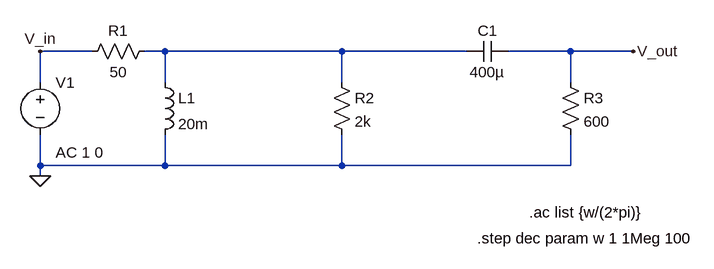
[diagram p0: schematic UE9_circuit.asc]
UE9_circuit.asc, the LTspice schematic file:
Version 4
SHEET 1 1116 680
WIRE 48 80 -32 80
WIRE 160 80 128 80
WIRE 432 80 160 80
WIRE 624 80 432 80
WIRE 784 80 688 80
WIRE 880 80 784 80
WIRE -32 128 -32 80
WIRE 160 128 160 80
WIRE 432 128 432 80
WIRE 784 128 784 80
WIRE -32 256 -32 208
WIRE 160 256 160 208
WIRE 160 256 -32 256
WIRE 432 256 432 208
WIRE 432 256 160 256
WIRE 784 256 784 208
WIRE 784 256 432 256
WIRE -32 272 -32 256
FLAG -32 272 0
FLAG -32 80 V_in
FLAG 880 80 V_out
SYMBOL res 144 64 R90
WINDOW 0 0 56 VBottom 2
WINDOW 3 32 56 VTop 2
SYMATTR InstName R1
SYMATTR Value 50
SYMBOL ind 144 112 R0
SYMATTR InstName L1
SYMATTR Value 20m
SYMBOL res 416 112 R0
SYMATTR InstName R2
SYMATTR Value 2k
SYMBOL res 768 112 R0
SYMATTR InstName R3
SYMATTR Value 600
SYMBOL cap 688 64 R90
WINDOW 0 0 32 VBottom 2
WINDOW 3 32 32 VTop 2
SYMATTR InstName C1
SYMATTR Value 400µ
SYMBOL voltage -32 112 R0
WINDOW 123 24 124 Left 2
WINDOW 39 0 0 Left 0
SYMATTR InstName V1
SYMATTR Value ""
SYMATTR Value2 AC 1 0
TEXT 720 328 Left 2 !.ac list {w/(2*pi)}
TEXT 640 368 Left 2 !.step dec param w 1 1Meg 100

The netlist it stands for:
* UE9_circuit.asc
R1 N001 V_in 50
L1 N001 0 20m
R2 N001 0 2k
R3 V_out 0 600
C1 V_out N001 400µ
V1 V_in 0 AC 1 0
.ac list {w/(2*pi)}
.step dec param w 1 1Meg 100
.backanno
.end